# EAGLE design ts52002-breakout (EAGLE 8.4.1)
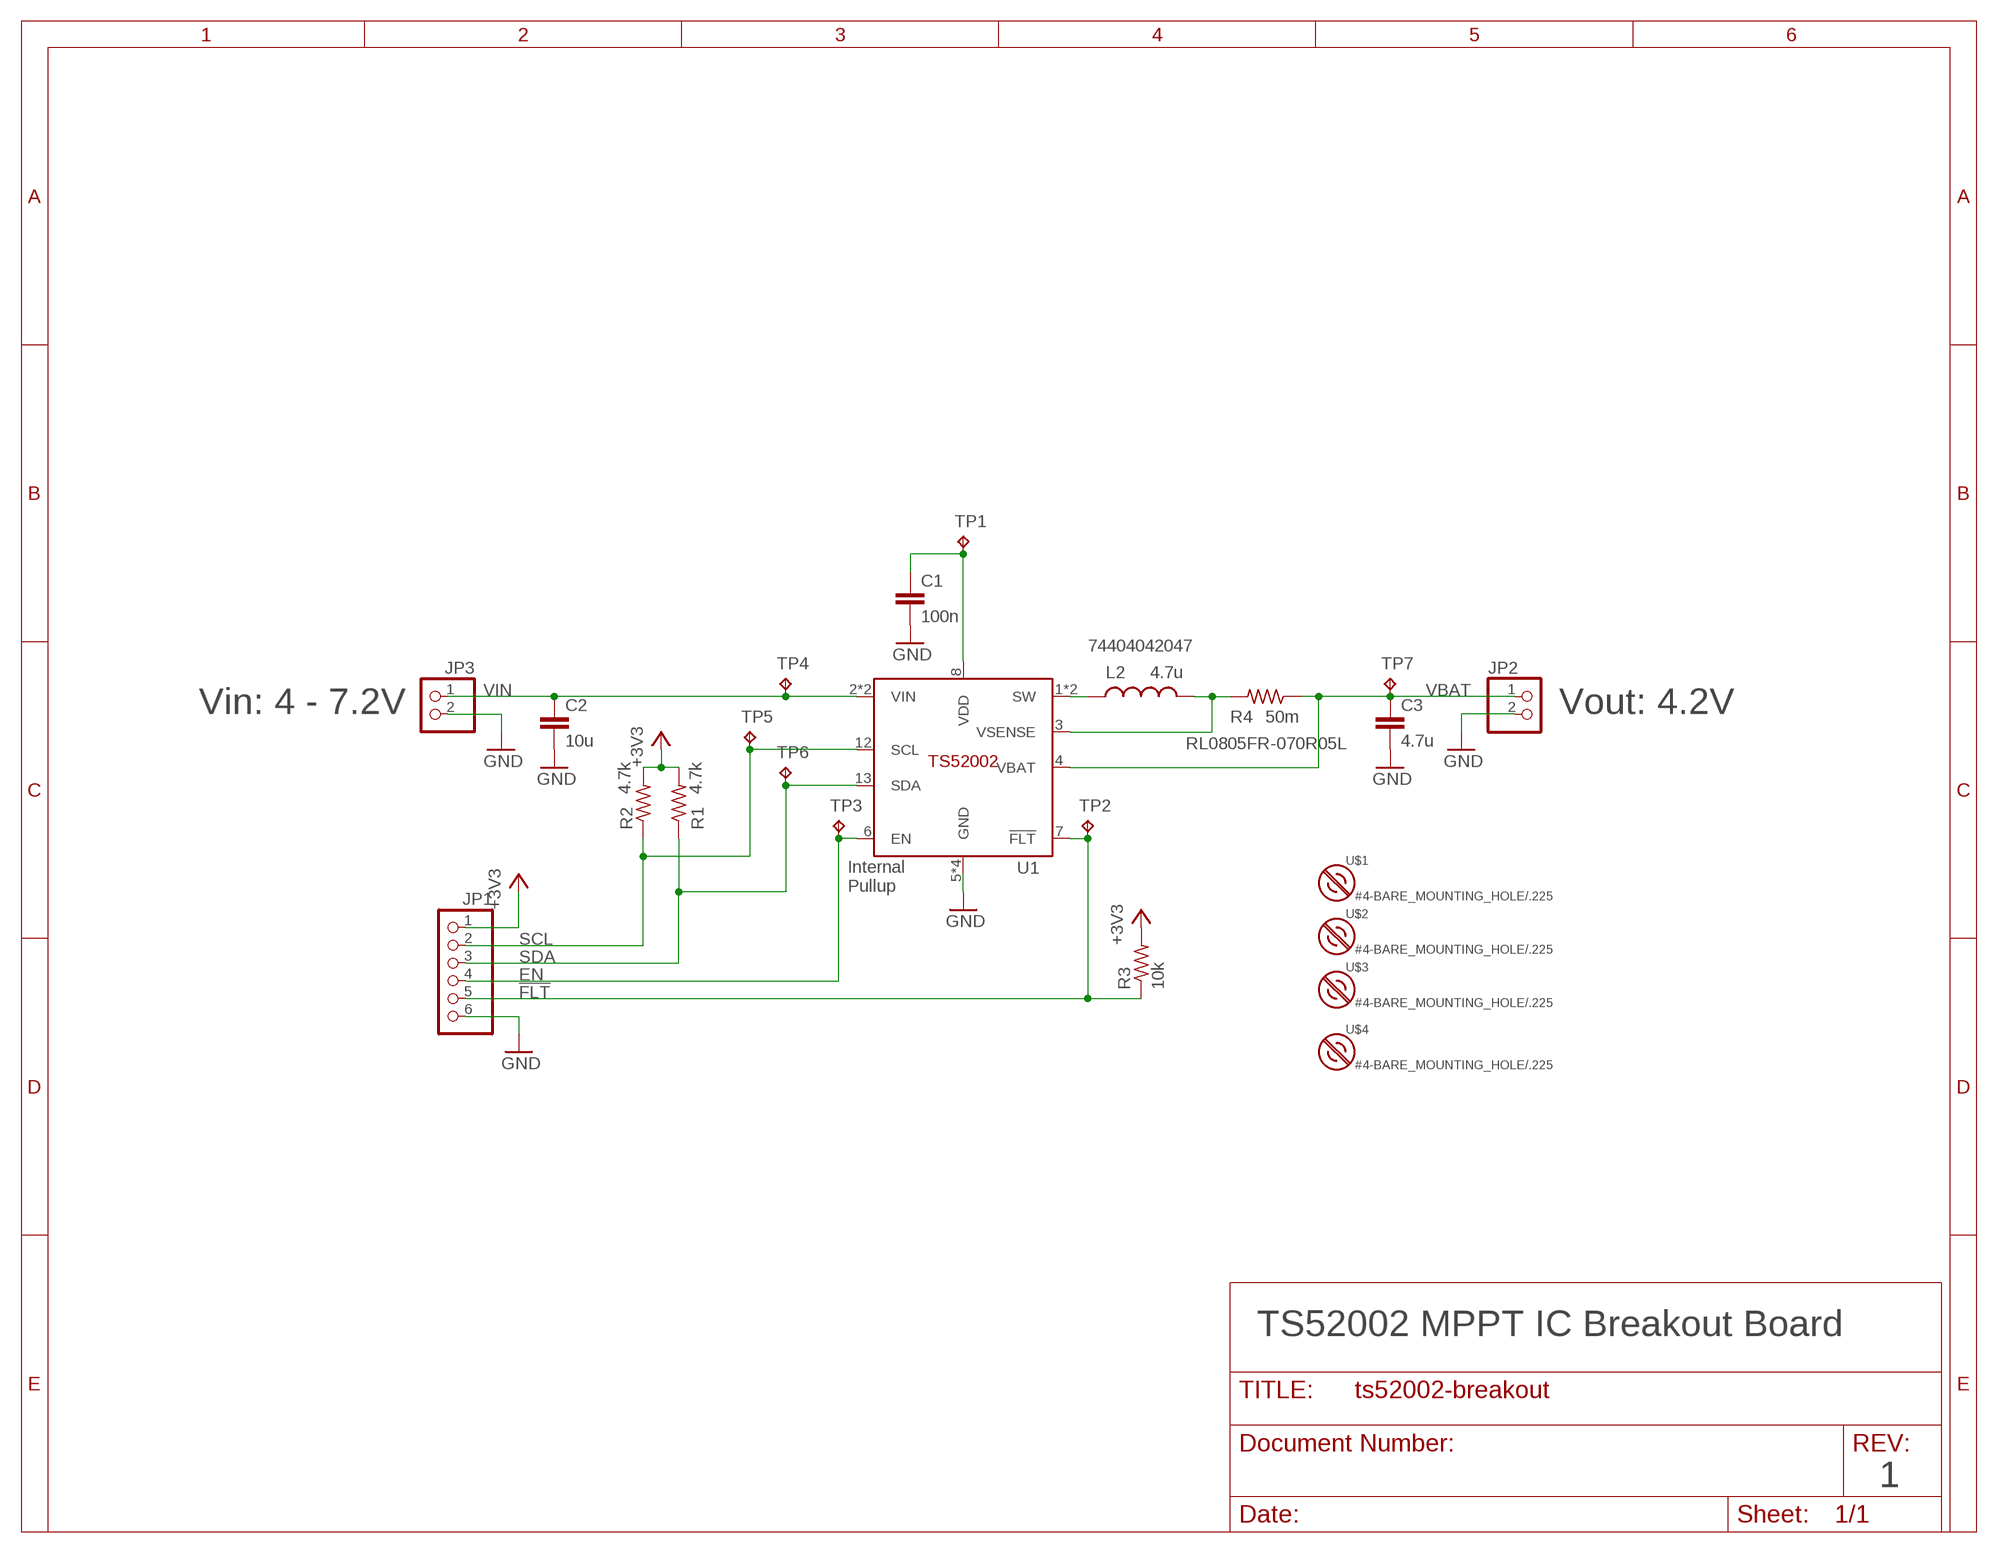
[diagram p0: schematic, sheet 1]

## Parts
C1  100n  C-EU0603-B-NOSILK  [.0603-B-NOSILK]
C2  10u  C-EU0805-B-NOSILK  [.0805-B-NOSILK]
C3  4.7u  C-EU0805-B-NOSILK  [.0805-B-NOSILK]
JP1  PINHD-1X6  [1X06]
JP2  PINHD-1X2  [1X02]
JP3  PINHD-1X2  [1X02]
L2  4.7u  WURTH-4518-INDUCTOR  [WURTH-4518]
R1  4.7k  R-US_0603-B-NOSILK  [.0603-B-NOSILK]
R2  4.7k  R-US_0603-B-NOSILK  [.0603-B-NOSILK]
R3  10k  R-US_0603-B-NOSILK  [.0603-B-NOSILK]
R4  50m  R-US_0805-B-NOSILK  [.0805-B-NOSILK]
TP1  TPPAD1-13  [P1-13]
TP2  TPPAD1-13  [P1-13]
TP3  TPPAD1-13  [P1-13]
TP4  TPPAD1-13  [P1-13]
TP5  TPPAD1-13  [P1-13]
TP6  TPPAD1-13  [P1-13]
TP7  TPPAD1-13  [P1-13]
U1  TS52002  [QFN-32-WITH-CENTER-PAD]
U$1  #4-BARE_MOUNTING_HOLE/.225  [#4/.225-BARE+HEAD_OR_SMALL_NUT]
U$2  #4-BARE_MOUNTING_HOLE/.225  [#4/.225-BARE+HEAD_OR_SMALL_NUT]
U$3  #4-BARE_MOUNTING_HOLE/.225  [#4/.225-BARE+HEAD_OR_SMALL_NUT]
U$4  #4-BARE_MOUNTING_HOLE/.225  [#4/.225-BARE+HEAD_OR_SMALL_NUT]

## Nets
!FLT: JP1.5 R3.1 TP2.TP U1.7(!FLT)
+3V3: JP1.1 R1.2 R2.2 R3.2
EN: JP1.4 TP3.TP U1.6(EN)
GND: C1.2 C2.2 C3.2 JP1.6 JP2.2 JP3.2 U1.5(GND) U1.15(GND) U1.16(GND) U1.PAD(GND)
SCL: JP1.2 R2.1 TP5.TP U1.12(SCL)
SDA: JP1.3 R1.1 TP6.TP U1.13(SDA)
SW: L2.P$1 U1.1(SW) U1.14(SW)
VBAT: C3.1 JP2.1 R4.1 TP7.TP U1.4(VBAT)
VDD: C1.1 TP1.TP U1.8(VDD)
VIN: C2.1 JP3.1 TP4.TP U1.2(VIN) U1.11(VIN)
VSENSE: L2.P$2 R4.2 U1.3(VSENSE)

## Notes on the sheet
- 74404042047
- Vin: 4 - 7.2V | Vout: 4.2V
- RL0805FR-070R05L
- Internal
  Pullup
- TS52002 MPPT IC Breakout Board
- 1

## Library data of the parts
C1-C3 = rcl_custom:C-EU: CAPACITOR, European symbol
JP1 = pinhead:PINHD-1X6: PIN HEADER
JP2 JP3 = pinhead:PINHD-1X2: PIN HEADER
L2 = wurth-4518-inductor:WURTH-4518-INDUCTOR
R1-R4 = rcl_custom:R-US_: RESISTOR, American symbol
TP1-TP7 = testpad:TP: Test pad
U1 = ts52002:TS52002
U$1-U$4 = mount:#4-BARE_MOUNTING_HOLE: 1/8" drill hole for #4 screw mount

## Board
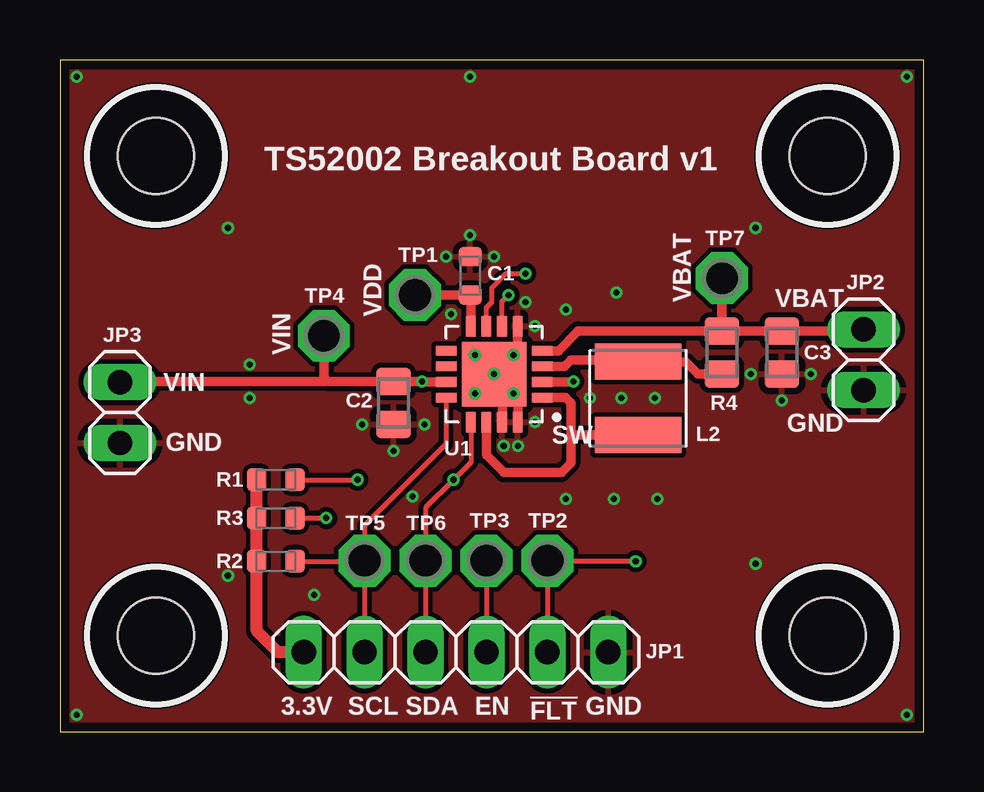
[diagram p1: board, top side]
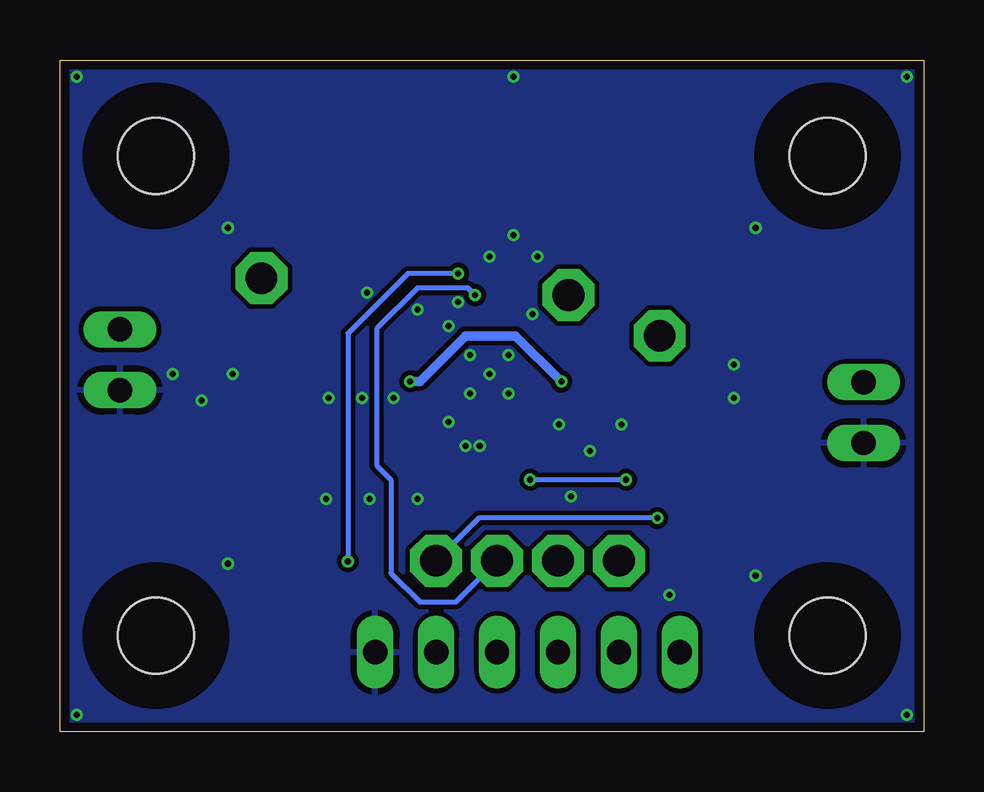
[diagram p2: board, bottom side, seen from below]

Size 36 x 28 mm. Coordinates in mm from the lower left corner, seen from the top.
Outline: 0,0 36,0 36,28 0,28 0,0
Copper layers (1*16): Top 0.035559375mm / dielectric 1.6mm / Bottom 0.035559375mm
Design rules "OSH-Park-2-layer *": minimum track width 6mil, minimum drill 10mil, track to track 6mil, track to pad 6mil, pad to pad 6mil, via to via 6mil, smd to smd 6mil, copper to edge 15mil, drill to drill 6mil, minimum pad ring 5mil, minimum via ring 5mil, stop-mask expansion 2.5mil, vias tented up to drill 10mil, thermal gap 10mil
tRestrict: 4 lines

### Footprints (pad centres in the part's own frame; a part is rotated, then mirrored left to right if it is on the bottom)
.0603-B-NOSILK = smd 0.8 x 0.95: 1 -0.8,0; 2 0.8,0
.0805-B-NOSILK = smd 1.15 x 1.45: 1 -0.9,0; 2 0.9,0
1X06 = drill 1.016 long: 1 -6.35,0; 2 -3.81,0; 3 -1.27,0; 4 1.27,0; 5 3.81,0; 6 6.35,0
1X02 = drill 1.016 long: 1 -1.27,0; 2 1.27,0
WURTH-4518 = smd 1.5 x 3.6: P$1 -1.525,0; P$2 1.525,0
P1-13 = drill 1.321 pad 2.159 octagon: TP 0,0
QFN-32-WITH-CENTER-PAD = smd 0.85 x 0.4: 1 -2,0.975; 2 -2,0.325; 3 -2,-0.325; 4 -2,-0.975; 9 2,-0.975; 10 2,-0.325; 11 2,0.325; 12 2,0.975 | smd 0.4 x 0.85: 5 -0.975,-2; 6 -0.325,-2; 7 0.325,-2; 8 0.975,-2; 13 0.975,2; 14 0.325,2; 15 -0.325,2; 16 -0.975,2 | smd 2.7 x 2.7: PAD 0,0
#4/.225-BARE+HEAD_OR_SMALL_NUT = hole 3.175: 0,0

### Placement (x,y rotation side)
C1  17.1,19 90 top
C2  13.9,13.7 270 top
C3  30.1,15.8 270 top
JP1  16.51,3.31 0 top
JP2  33.5,15.5 270 top
JP3  2.5,13.3 270 top
L2  24.1,13.9 90 top
R1  9,10.5 180 top
R2  9,7.1 180 top
R3  9,8.9 180 top
R4  27.6,15.8 270 top
TP1  14.8,18.2 0 top
TP2  20.32,7.12 0 top
TP3  17.78,7.12 0 top
TP4  11,16.5 0 top
TP5  12.7,7.12 0 top
TP6  15.24,7.12 0 top
TP7  27.6,18.9 0 top
U1  18.1,14.9 180 top
U$1  4,4 0 top
U$2  32,4 0 top
U$3  4,24 0 top
U$4  32,24 0 top

### Tracks (layer width: path | path; a pad name or v marks a point on that pad's centre or on a via)
!FLT  (via drill 0.25)
  Top 0.2: JP1.5 TP2.TP 20.34,7.1 v24,7.1 | R3.1 v11.1,8.9 | v19.4,19.1 18.6,19.1 18,18.5 18,17.9 17.77,17.68 U1.7
  Bottom 0.2: v11.1,8.9 18.54,8.9 TP2.TP | v19.4,19.1 21.5,19.1 24,16.6 v24,7.1
+3V3
  Top 0.5: JP1.1 9.09,3.31 8.2,4.2 R2.2 R3.2 R1.2
EN  (via drill 0.25)
  Top 0.2: TP3.TP JP1.4 | U1.6 18.43,17.93 v18.7,18.2
  Bottom 0.2: v18.7,18.2 19,18.5 21.1,18.5 22.8,16.8 22.8,11.1 22.2,10.5 22.2,6.6 21,5.4 19.5,5.4 TP3.TP
GND  (via drill 0.25)
  Top 0.4: U1.15 18.46,14.6 U1.PAD | U1.16 19.11,13.95 U1.PAD | U1.5 19.07,15.88 U1.PAD
  other vias: 18.5,11.9 19.8,12.9 19.4,17.9 19.8,16.9 12.6,12.8 30.1,13.8 13.9,11.7 18.1,19.8 17.1,20.7 18.1,14.9 16.3,17.4 21.1,9.7 23.1,9.7 24.9,9.7 14.7,9.8 10.6,5.7 35.3,27.3 35.3,0.7 0.7,0.7 0.7,27.3 7.9,15.3 7.9,13.9 15.2,12.8 28.8,14.9 31.3,14.9 16.1,19.8 17.3,15.7 18.9,15.7 18.9,14.1 17.3,14.1 7,6.5 7,21 29,21 29,7 19.1,11.9 17.1,27.3 23.4,13.9 24.8,13.9 22.1,13.9 23.2,18.3 21.1,17.6
  pour Top (isolate 0.2): 0,0 0,28 36,28 36,0
  pour Bottom (isolate 0.2): 0,0 0,28 36,28 36,0
SCL
  Top 0.2: TP5.TP 12.7,8.6 16.1,12 U1.12 | TP5.TP JP1.2 | R2.1 12.68,7.1 TP5.TP
SDA  (via drill 0.25)
  Top 0.2: JP1.3 TP6.TP 15.24,9.34 v16.4,10.5 17.12,11.22 U1.13 | R1.1 v12.4,10.5
  Bottom 0.2: v12.4,10.5 v16.4,10.5
SW
  Top 0.4: U1.14 17.77,11.53 18.5,10.8 20.9,10.8 21.3,11.2 21.3,12.5 | U1.1 21.07,13.93 21.3,13.7 21.3,12.5 | L2.P$1 21.32,12.38 21.3,12.5
VBAT
  Top 0.4: R4.1 21.6,16.7 20.77,15.88 U1.4 | R4.1 TP7.TP | R4.1 C3.1 32.57,16.7 JP2.1
VDD
  Top 0.4: TP1.TP C1.1 17.16,18.14 17.12,18.09 U1.8
VIN  (via drill 0.25)
  Top 0.4: 11.1,14.6 C2.1 v15.1,14.6 15.12,14.57 U1.11 | 11.1,14.6 3.73,14.6 JP3.1 | TP4.TP 11,14.7 11.1,14.6 | U1.2 21.38,14.57 v21.4,14.6
  Bottom 0.4: v15.11,14.6 v15.1,14.6 17,16.5 19.1,16.5 21,14.6 v21.4,14.6
VSENSE
  Top 0.4: U1.3 21.02,15.22 21.3,15.5 24.07,15.5 L2.P$2 24.12,15.4 26.1,15.4 26.6,14.9 R4.2

### Text on the board
tPlace: TS52002 Breakout Board v1 | VBAT | VBAT | VDD | VIN | VIN | GND | SW | GND | 3.3V | SCL | SDA | EN | GND | !FLT